# EAGLE design AstableVibrator (EAGLE 9.6.2)
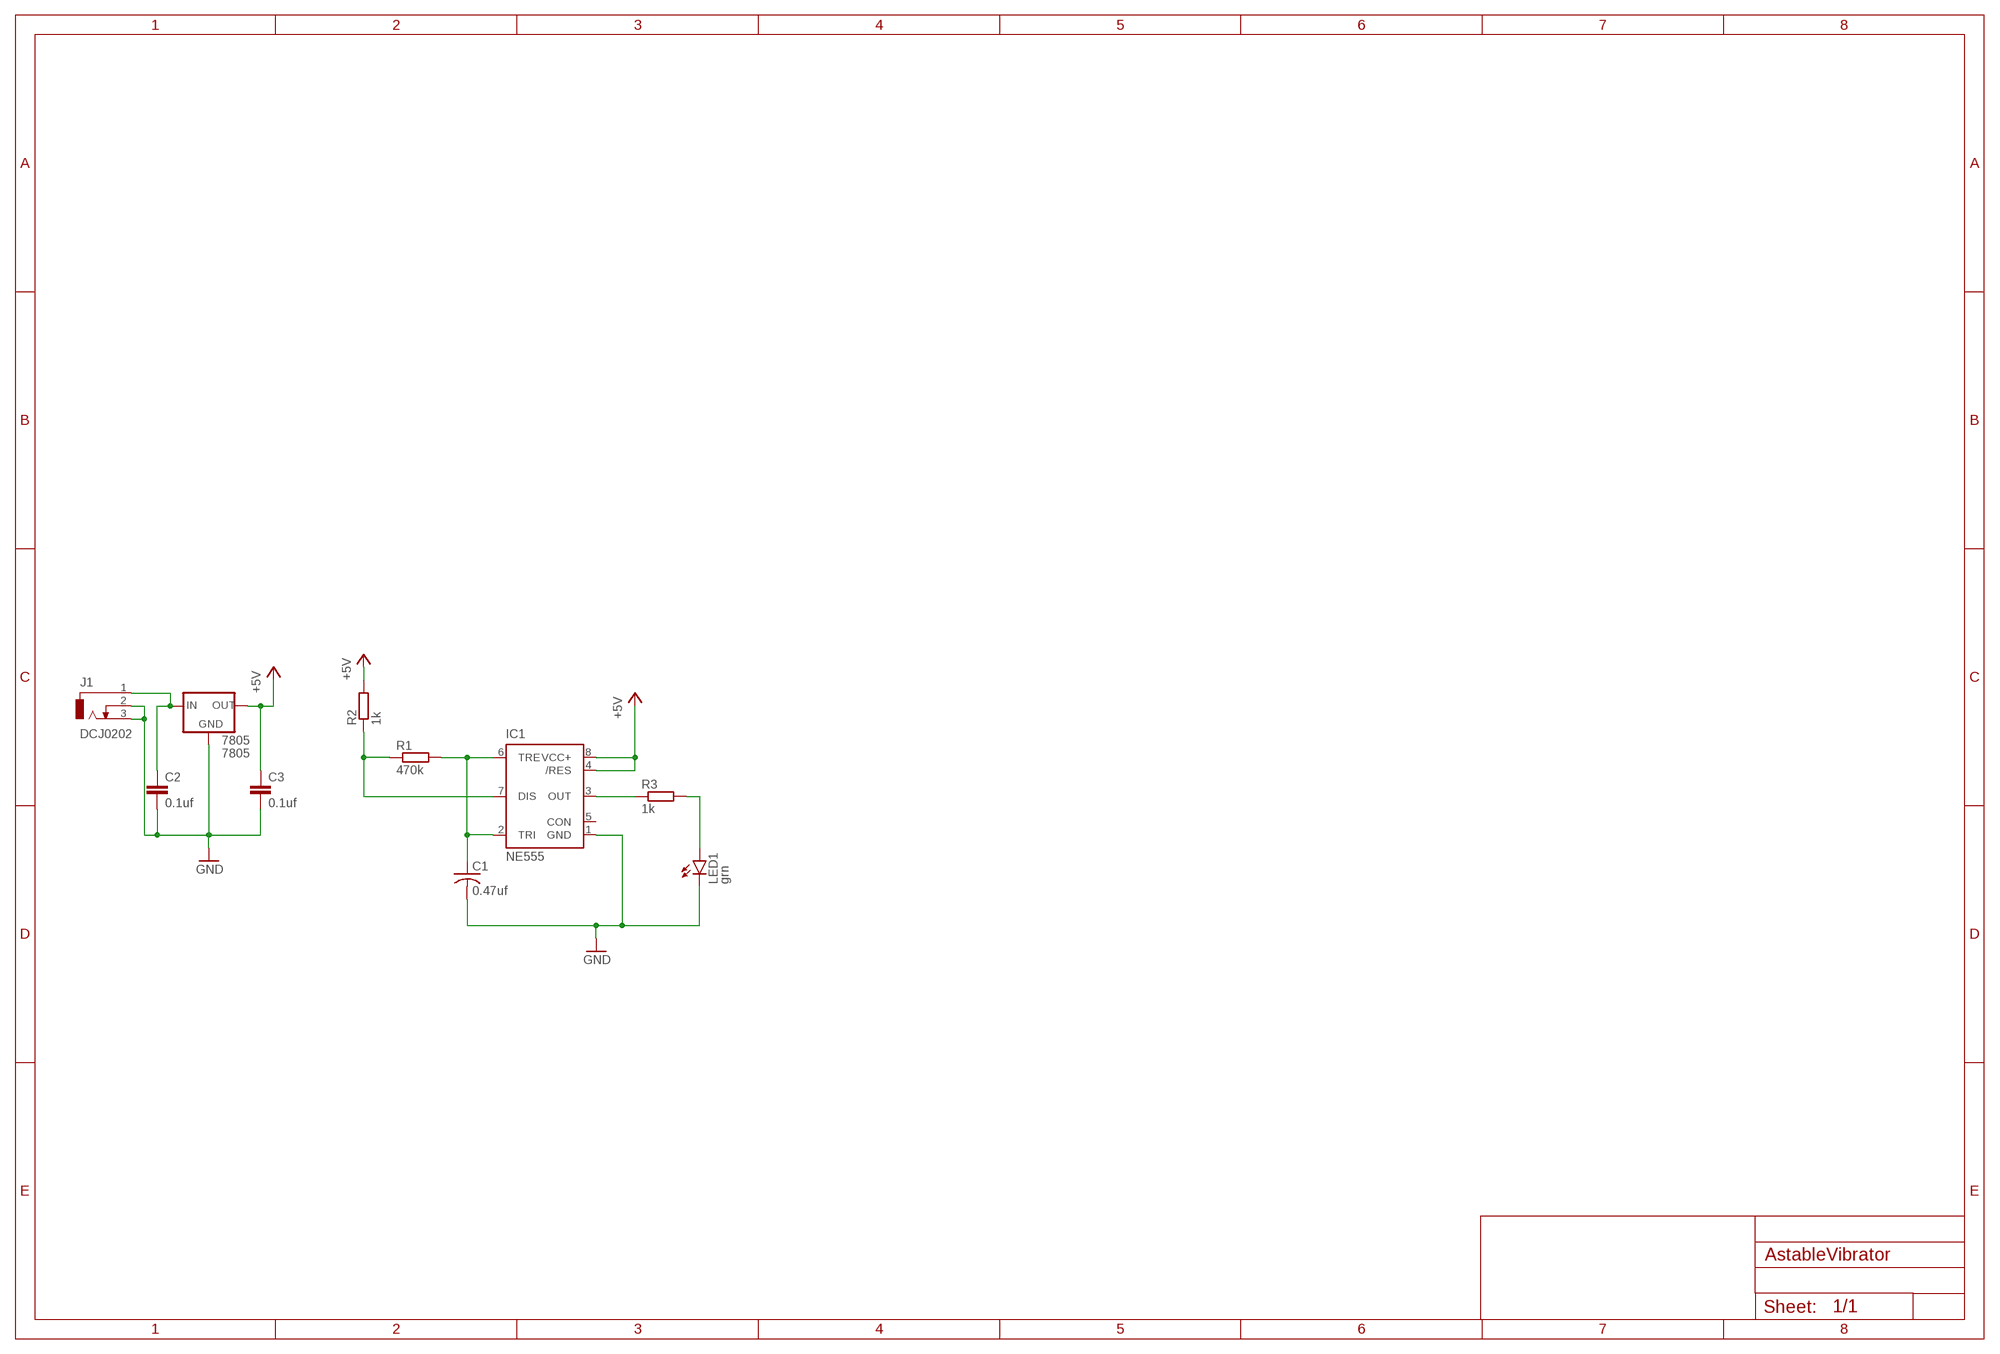
[diagram p0: schematic, sheet 1]

## Parts
7805  7805  78MXXS  [78MXXS]
C1  0.47uf  C-US025_050-045X075  [C025_050-045X075]
C2  0.1uf  C-EU025-050X050  [C025-050X050]
C3  0.1uf  C-EU025-050X050  [C025-050X050]
IC1  NE555  [DIL-08]
J1  DCJ0202  [DCJ0202]
LED1  grn  LED5MM  [LED5MM]
R1  470k  R-EU_0411/15  [0411/15]
R2  1k  R-EU_0411/15  [0411/15]
R3  1k  R-EU_0411/15  [0411/15]

## Nets
+5V: 7805.OUT C3.1 IC1.4(/RES) IC1.8(VCC+) R2.2
GND: 7805.GND C1.2 C2.2 C3.2 IC1.1(GND) J1.2 J1.3 LED1.K(C)
N$1: IC1.3(OUT) R3.1
N$2: LED1.A R3.2
N$3: IC1.7(DIS) R1.1 R2.1
N$5: C1.1 IC1.2(TRI) IC1.6(TRE) R1.2
N$9: 7805.IN C2.1 J1.1
Unconnected: IC1.5(CON)

## Library data of the parts
7805 = v-reg:78MXXS: VOLTAGE REGULATOR
C1 = rcl:C-US: CAPACITOR, American symbol; SPICEPREFIX: C
C2 C3 = rcl:C-EU: CAPACITOR, European symbol; SPICEPREFIX: C
IC1 = st-microelectronics:NE555: General purpose bipolar Timer; MF: Arrow Electronics; MPN: NE555N; OC_FARNELL: 1467742; OC_NEWARK: 89K1486
J1 = con-jack:DCJ0202: DC POWER JACK Source: DCJ0202.pdf; OC_FARNELL: unknown; OC_NEWARK: unknown
LED1 = led:LED: LED OSRAM: - CHIPLED LG R971, LG N971, LY N971, LG Q971, LY Q971, LO R971, LY R971 LH N974, LH R974 LS Q976, LO Q976, LY Q976 LO Q996 - Hyper CHIPLED LW Q18S LB Q993, LB Q99A, LB R99A - SideLED LS A670, LO A670, LY A670, LG A670, LP A670 LB A673, LV A673, LT A673, LW A673 LH A674 LY A675 LS A676, LA A676, LO A676, LY A676, LW A676 LS A679, LY A679, LG A679 - Hyper Micro SIDELED® LS Y876, LA Y876, LO Y876, LY Y876 LT Y87S - SmartLED LW L88C, LW L88S LB L89C, LB L89S, LG L890 LS L89K, LO L89K, LY L89K LS L896, LA L896, LO L896, LY L896 - TOPLED LS T670, LO T670, LY T670, LG T670, LP T670 LSG T670, LSP T670, LSY T670, LOP T670, LYG T670 LG T671, LOG T671, LSG T671 LB T673, LV T673, LT T673, LW T673 LH T674 LS T676, LA T676, LO T676, LY T676, LB T676, LH T676, LSB T676, LW T676 LB T67C, LV T67C, LT T67C, LS T67K, LO T67K, LY T67K, LW E67C LS E67B, LA E67B, LO E67B, LY E67B, LB E67C, LV E67C, LT E67C LW T67C LS T679, LY T679, LG T679 LS T770, LO T770, LY T770, LG T770, LP T770 LB T773, LV T773, LT T773, LW T773 LH T774 LS E675, LA E675, LY E675, LS T675 LS T776, LA T776, LO T776, LY T776, LB T776 LHGB T686 LT T68C, LB T68C - Hyper Mini TOPLED® LB M676 - Mini TOPLED Santana® LG M470 LS M47K, LO M47K, LY M47K Source: http://www.osram.convergy.de LUXEON: - LUMILED® LXK2-PW12-R00, LXK2-PW12-S00, LXK2-PW14-U00, LXK2-PW14-V00 LXK2-PM12-R00, LXK2-PM12-S00, LXK2-PM14-U00 LXK2-PE12-Q00, LXK2-PE12-R00, LXK2-PE12-S00, LXK2-PE14-T00, LXK2-PE14-U00 LXK2-PB12-K00, LXK2-PB12-L00, LXK2-PB12-M00, LXK2-PB14-N00, LXK2-PB14-P00, LXK2-PB14-Q00 LXK2-PR12-L00, LXK2-PR12-M00, LXK2-PR14-Q00, LXK2-PR14-R00 LXK2-PD12-Q00, LXK2-PD12-R00, LXK2-PD12-S00 LXK2-PH12-R00, LXK2-PH12-S00 LXK2-PL12-P00, LXK2-PL12-Q00, LXK2-PL12-R00 Source: www.luxeon.com KINGBRIGHT: KA-3528ASYC Source: www.kingbright.com
R1-R3 = rcl:R-EU_: RESISTOR, European symbol; SPICEPREFIX: R

## Board
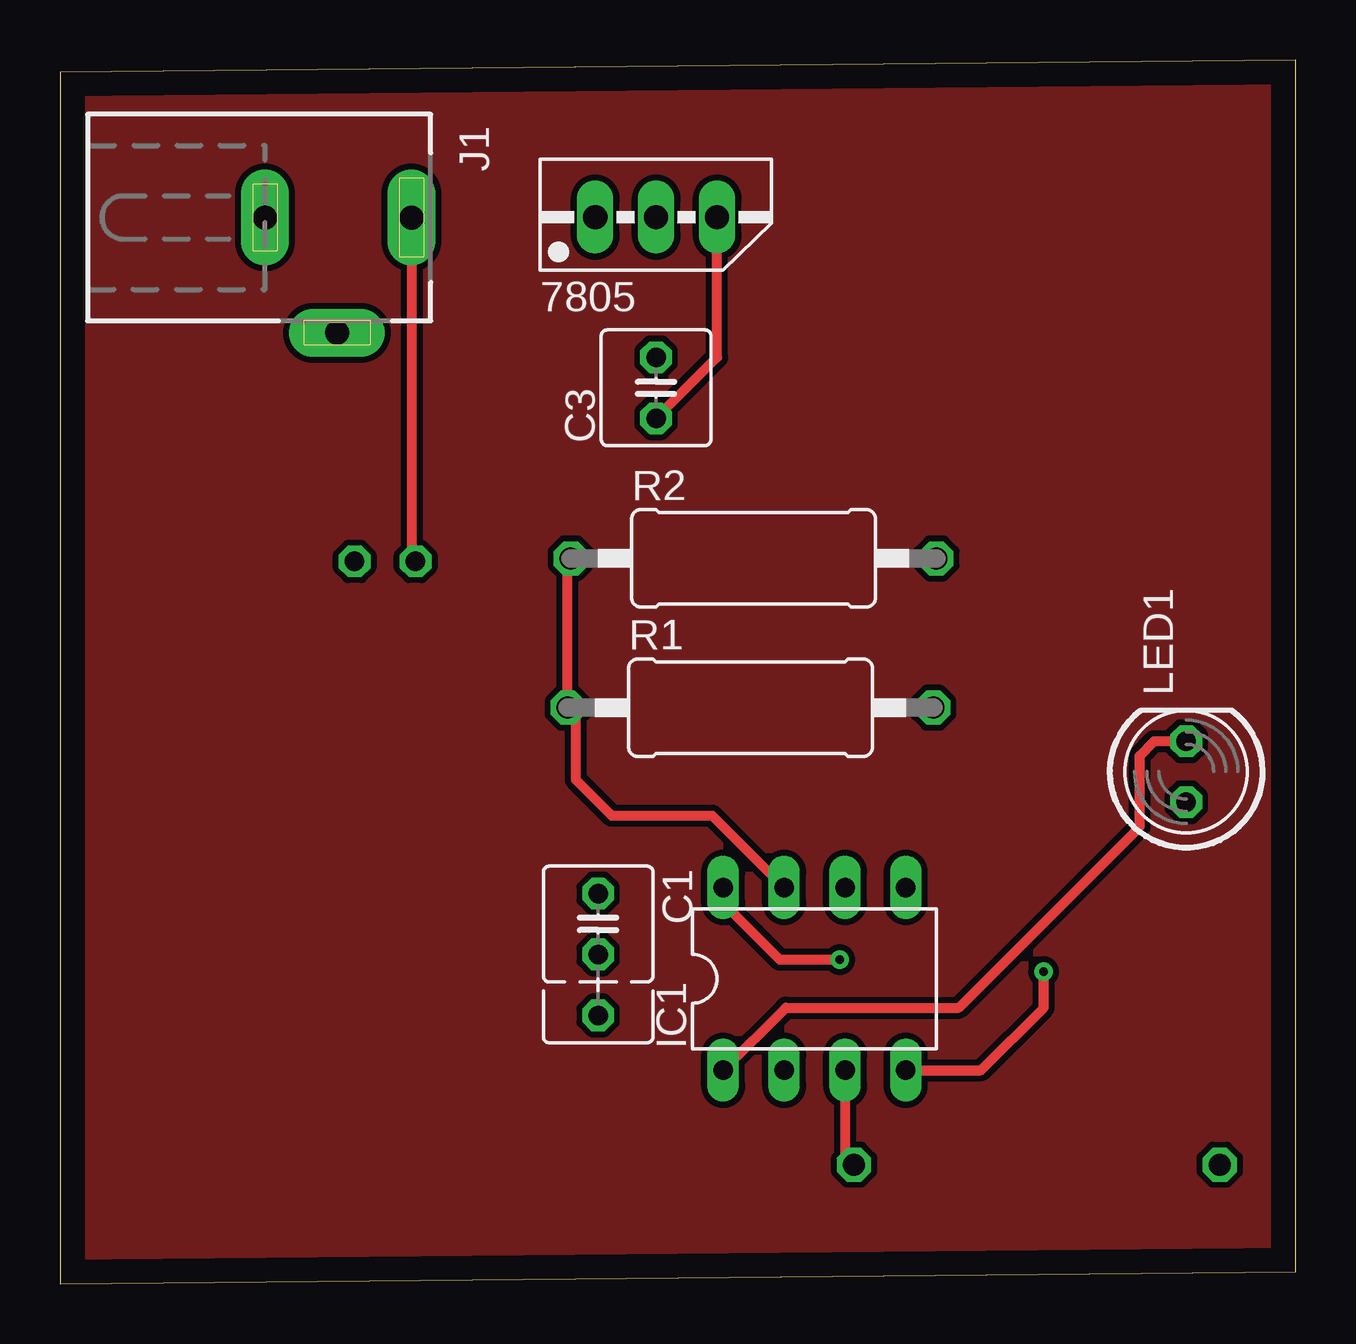
[diagram p1: board, top side]
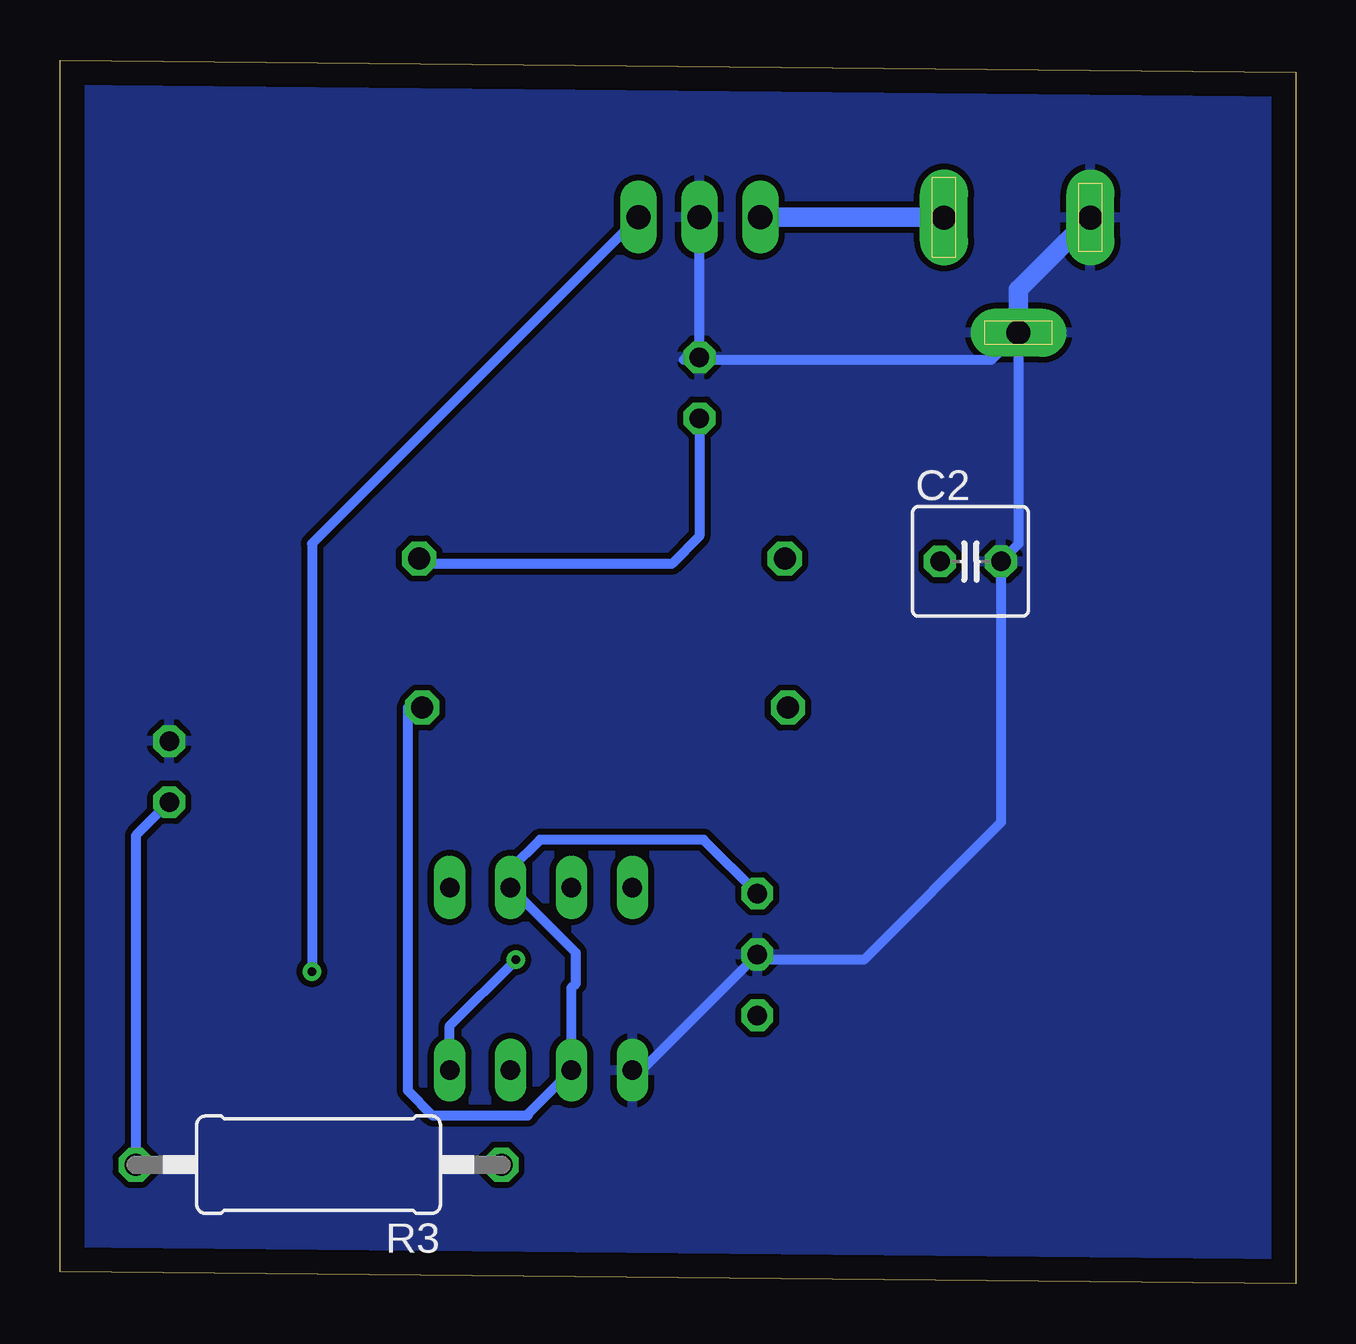
[diagram p2: board, bottom side, seen from below]

Size 51.5 x 51 mm. Coordinates in mm from the lower left corner, seen from the top.
Outline: 0,0 51.5,0.5 51.5,51 0,50.5 0,0
Copper layers (1*16): Top 0.035mm / dielectric 1.5mm / Bottom 0.035mm
Design rules "default *": minimum track width 6mil, minimum drill 0.35mm, track to track 10mil, track to pad 10mil, pad to pad 10mil, via to via 10mil, smd to smd 6mil, copper to edge 40mil, drill to drill 6mil, minimum pad ring 10mil, minimum via ring 8mil, stop-mask expansion 4mil, vias tented up to drill 0mil, thermal gap 10mil

### Footprints (pad centres in the part's own frame; a part is rotated, then mirrored left to right if it is on the bottom)
78MXXS = drill 1.016 long: GND 0,-2.54; IN -2.54,-2.54; OUT 2.54,-2.54
C025_050-045X075 = drill 0.813 octagon: 1 -1.27,0; 2 1.27,0; 3 3.81,0
C025-050X050 = drill 0.813 octagon: 1 -1.27,0; 2 1.27,0
DIL-08 = drill 0.813 long: 1 -3.81,-3.81; 2 -1.27,-3.81; 3 1.27,-3.81; 4 3.81,-3.81; 5 3.81,3.81; 6 1.27,3.81; 7 -1.27,3.81; 8 -3.81,3.81
DCJ0202 = drill 1 pad 2 long: 1 0,3.1; 2 4.8,0; 3 0,-3
LED5MM = drill 0.813 octagon: A -1.27,0; K 1.27,0
0411/15 = drill 0.914 octagon: 1 -7.62,0; 2 7.62,0

### Placement (x,y rotation side)
7805  24.85,46.99 0 top
C1  22.43,14.99 270 top
C2  13.55,30.1 0 bottom
C3  24.85,37.34 90 top
IC1  31.45,12.7 0 top
J1  11.55,44.43 270 top
LED1  46.94,21.34 90 top
R1  28.78,24 0 top
R2  28.91,30.23 0 top
R3  40.72,4.95 180 bottom

### Tracks (layer width: path | path; a pad name or v marks a point on that pad's centre or on a via)
+5V  (via drill 0.35)
  Top 0.406: IC1.4 38.39,8.89 41,11.5 v41,13 | C3.1 27.39,38.61 7805.OUT | v32.5,13.5 30,13.5 27.5,16 27.64,16.14 IC1.8
  Bottom 0.406: C3.1 24.85,31.15 26,30 36.3,30 R2.2 | 7805.OUT 41,30.84 v41,13 | IC1.4 35.26,10.74 v32.5,13.5
GND
  Top 0.406: IC1.1 30.25,11.5 37.46,11.5 45,19.04 45,22 45.61,22.61 LED1.K
  Bottom 0.406: IC1.1 27.26,8.89 C1.2 22.22,13.5 18,13.5 12.28,19.22 C2.2 11.55,30.83 J1.2 12.68,38.5 25.5,38.5 25.39,38.61 C3.2 7805.GND
  Bottom 0.813: J1.3 11.55,41.43 J1.2
  pour Bottom: 0.5,50.5 52,50.5 52,0 0,0 0,51
N$1
  Top 0.406: IC1.3 32.72,5.33 R3.1
N$2
  Bottom 0.406: LED1.A 48.34,18.67 R3.2
N$3
  Top 0.406: IC1.7 27.19,19.5 23,19.5 21.5,21 21.5,23.67 R1.1 21.16,30.1 R2.1
N$5
  Bottom 0.406: C1.1 24.68,18.5 31.5,18.5 32.72,17.28 IC1.6 30,13.79 30,12.5 30.18,12.32 IC1.2 32,7.07 32,7 35.97,7 37,8.03 37,24 R1.2
N$9
  Top 0.406: J1.1 14.65,30.27 C2.1
  Bottom 0.813: J1.1 14.67,44.45 7805.IN
SIG
  pour Top: 0.5,51 51.5,51 52,50.5 52,0 0.5,0 0,0.5 0,50.5